# Altium schematic sheet Slave_Sheet2.SchDoc
size A4
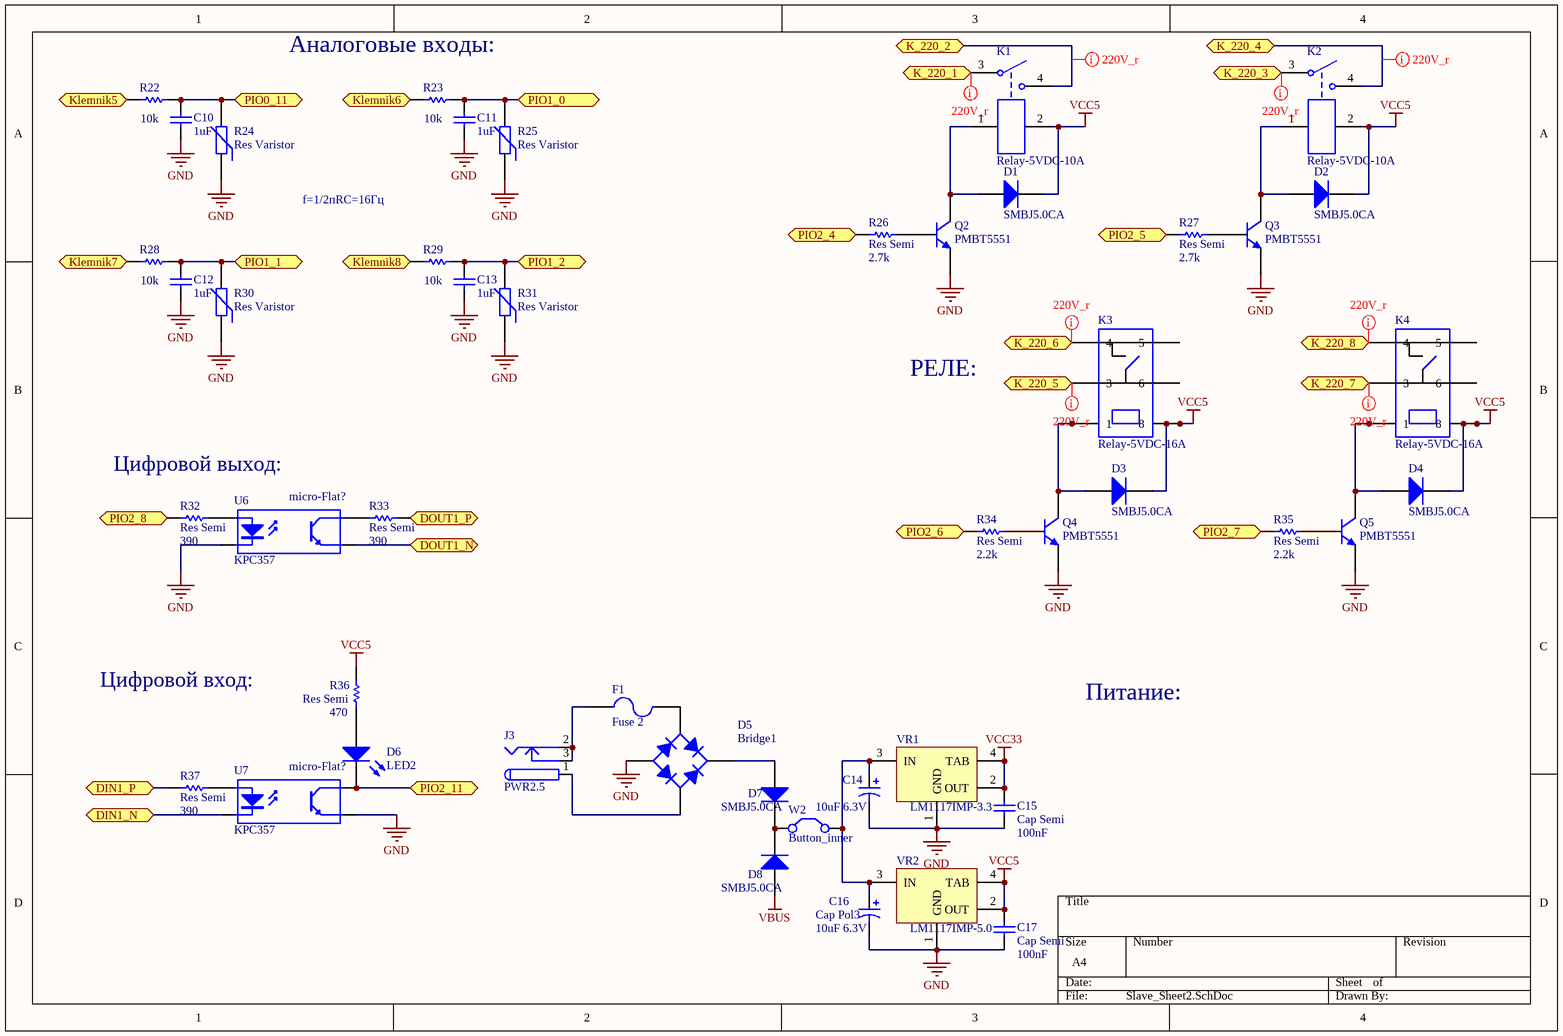
[diagram p0: Slave_Sheet2.SchDoc]

## Parts
C10  value 1uF  [CAPC2012M]  (hidden comment: Cap Semi)
C11  value 1uF  [CAPC2012M]  (hidden comment: Cap Semi)
C12  value 1uF  [CAPC2012M]  (hidden comment: Cap Semi)
C13  value 1uF  [CAPC2012M]  (hidden comment: Cap Semi)
C14  value 10uF 6.3V  [CAPC4532L]  (hidden comment: Cap Pol3)
C15  Cap Semi  value 100nF  [CAPC2012M]
C16  Cap Pol3  value 10uF 6.3V  [CAPC4532L]
C17  Cap Semi  value 100nF  [CAPC2012M]
D1  SMBJ5.0CA  [SMB]
D2  SMBJ5.0CA  [SMB]
D3  SMBJ5.0CA  [SMB]
D4  SMBJ5.0CA  [SMB]
D5  Bridge1  [DB-1S]
D6  LED2  [CD3216-1206]
D7  SMBJ5.0CA  [SMB]
D8  SMBJ5.0CA  [SMB]
F1  Fuse 2  [CD4532-1812]
J3  PWR2.5  [KLD-0202]
K1  Relay-5VDC-10A  [TRCF-SB]
K2  Relay-5VDC-10A  [TRCF-SB]
K3  Relay-5VDC-16A  [TRIH-AE]
K4  Relay-5VDC-16A  [TRIH-AE]
Q2  PMBT5551  [SOT23_M]
Q3  PMBT5551  [SOT23_M]
Q4  PMBT5551  [SOT23_M]
Q5  PMBT5551  [SOT23_M]
R22  value 10k  [RESC2012M]  (hidden comment: Res Semi)
R23  value 10k  [RESC2012M]  (hidden comment: Res Semi)
R24  Res Varistor  [RESC3216L]
R25  Res Varistor  [RESC3216L]
R26  Res Semi  value 2.7k  [RESC2012M]
R27  Res Semi  value 2.7k  [RESC2012M]
R28  value 10k  [RESC2012M]  (hidden comment: Res Semi)
R29  value 10k  [RESC2012M]  (hidden comment: Res Semi)
R30  Res Varistor  [RESC3216L]
R31  Res Varistor  [RESC3216L]
R32  Res Semi  value 390  [RESC2012M]
R33  Res Semi  value 390  [RESC2012M]
R34  Res Semi  value 2.2k  [RESC2012M]
R35  Res Semi  value 2.2k  [RESC2012M]
R36  Res Semi  value 470  [RESC2012M]
R37  Res Semi  value 390  [RESC2012M]
U6  KPC357  [Micro-Flat]
U7  KPC357  [Micro-Flat]
VR1  LM1117IMP-3.3  [MP04A_N]
VR2  LM1117IMP-5.0  [MP04A_N]
W2  Button_inner  [HDR1X2]

## Ports
DIN1_N (bidir), DIN1_P (bidir), DOUT1_N (bidir), DOUT1_P (bidir), K_220_1 (bidir), K_220_2 (bidir), K_220_3 (bidir), K_220_4 (bidir), K_220_5 (bidir), K_220_6 (bidir), K_220_7 (bidir), K_220_8 (bidir), Klemnik5 (bidir), Klemnik6 (bidir), Klemnik7 (bidir), Klemnik8 (bidir), PIO0_11 (bidir), PIO1_0 (bidir), PIO1_1 (bidir), PIO1_2 (bidir), PIO2_4 (bidir), PIO2_5 (bidir), PIO2_6 (bidir), PIO2_7 (bidir), PIO2_8 (bidir), PIO2_11 (bidir)

## Nets
GND: C10.1 C11.1 C12.1 C13.1 C14.2 C15.1 C16.2 C17.1 D5.3(A) Q2.2(E) Q3.2(E) Q4.2(E) Q5.2(E) R24.1 R25.1 R30.1 R31.1 U6.2(K) U7.3(E) VR1.1(GND) VR2.1(GND)
VBUS: D8.1(A)
VCC5: C17.2 D1.2(K) D2.2(K) D3.2(K) D4.2(K) K1.2 K2.2 K3.8 K4.8 R36.1 VR2.2(OUT) VR2.4(TAB)
VCC33: C15.2 VR1.2(OUT) VR1.4(TAB)
DIN1_N: U7.2(K) ; port DIN1_N
DIN1_P: R37.2 ; port DIN1_P
DOUT1_N: U6.3(E) ; port DOUT1_N
DOUT1_P: R33.1 ; port DOUT1_P
K_220_1: K1.3 ; port K_220_1
K_220_2: K1.4 ; port K_220_2
K_220_3: K2.3 ; port K_220_3
K_220_4: K2.4 ; port K_220_4
K_220_5: K3.3 ; port K_220_5
K_220_6: K3.4 ; port K_220_6
K_220_7: K4.3 ; port K_220_7
K_220_8: K4.4 ; port K_220_8
Klemnik5: R22.2 ; port Klemnik5
Klemnik6: R23.2 ; port Klemnik6
Klemnik7: R28.2 ; port Klemnik7
Klemnik8: R29.2 ; port Klemnik8
PIO0_11: C10.2 R22.1 R24.2 ; port PIO0_11
PIO1_0: C11.2 R23.1 R25.2 ; port PIO1_0
PIO1_1: C12.2 R28.1 R30.2 ; port PIO1_1
PIO1_2: C13.2 R29.1 R31.2 ; port PIO1_2
PIO2_4: R26.2 ; port PIO2_4
PIO2_5: R27.2 ; port PIO2_5
PIO2_6: R34.2 ; port PIO2_6
PIO2_7: R35.2 ; port PIO2_7
PIO2_8: R32.2 ; port PIO2_8
PIO2_11: D6.2(K) U7.4(C) ; port PIO2_11
NetC14_1: C14.1 C16.1 VR1.3(IN) VR2.3(IN) W2.2(C2)
NetD1_1: D1.1(A) K1.1 Q2.3(C)
NetD2_1: D2.1(A) K2.1 Q3.3(C)
NetD3_1: D3.1(A) K3.1 Q4.3(C)
NetD4_1: D4.1(A) K4.1 Q5.3(C)
NetD5_1: D5.1(K) D7.1(A)
NetD5_2: D5.2(C) J3.1
NetD5_4: D5.4(C) F1.2
NetD6_1: D6.1(A) R36.2
NetD7_2: D7.2(K) D8.2(K) W2.1(C1)
NetF1_1: F1.1 J3.2 J3.3
NetQ2_1: Q2.1(B) R26.1
NetQ3_1: Q3.1(B) R27.1
NetQ4_1: Q4.1(B) R34.1
NetQ5_1: Q5.1(B) R35.1
NetR32_1: R32.1 U6.1(A)
NetR33_2: R33.2 U6.4(C)
NetR37_1: R37.1 U7.1(A)

Not connected (* = marked no-connect by the designer): K3 5 6; K4 5 6

## Layout directives
net class 220V_r: K_220_1, K_220_2, K_220_3, K_220_4, K_220_5, K_220_6, K_220_7, K_220_8

## Notes on the sheet
- Аналоговые входы:
- f=1/2пRC=16Гц
- РЕЛЕ:
- Цифровой выход:
- micro-Flat?
- Цифровой вход:
- Питание:
- (near D6) micro-Flat?

## Library data of the parts
C10-C13 C15 C17 = Cap Semi: Capacitor (Semiconductor SIM Model); Published: 8-Jun-2000; LatestRevisionDate: 29-May-2009; LatestRevisionNote: IPC-7351 Footprint Added.; PackageReference: C1206; Publisher: Altium Limited; PackageDescription: Chip Capacitor
C14 C16 = Cap Pol3: Polarized Capacitor (Surface Mount); Published: 8-Jun-2000; LatestRevisionDate: 29-May-2009; LatestRevisionNote: IPC-7351 Footprint Added.; PackageReference: C0805; Publisher: Altium Limited; PackageDescription: Chip Capacitor
D1-D4 D7 D8 = Diode 1N4007: 1 Amp General Purpose Rectifier; Published: 8-Jun-2000; LatestRevisionDate: 17-Jul-2002; LatestRevisionNote: Re-released for DXP Platform.; DatasheetDocument: 1998; PackageDocument: Aug-1999; PackageReference: DO-41; Publisher: Altium Limited; Code_JEDEC: DO-204-AL; ComponentLink1Description: Manufacturer Link; ComponentLink1URL: http://www.fairchildsemi.com/; ComponentLink2Description: Datasheet; ComponentLink2URL: http://www.fairchildsemi.com/ds/1N%2F1N4001.pdf
D5 = Bridge1: Full Wave Diode Bridge; Published: 8-Jun-2000; LatestRevisionDate: 29-May-2009; LatestRevisionNote: Sch pins A & K swapped.; DatasheetVersion: E2732B; PackageReference: D-38; Publisher: Altium Limited
D6 = LED2: Typical RED, GREEN, YELLOW, AMBER GaAs LED; Published: 8-Jun-2000; LatestRevisionDate: 17-Jul-2002; LatestRevisionNote: Re-released for DXP Platform.; PackageVersion: Feb-2002; PackageReference: 3.2X1.6X1.1; Publisher: Altium Limited
F1 = Fuse 2: Fuse; Published: 8-Jun-2000; LatestRevisionDate: 17-Jul-2002; LatestRevisionNote: Re-released for DXP Platform.; PackageReference: PIN-W2/E2.8; Publisher: Altium Limited
J3 = PWR2.5: Low Voltage Power Supply Connector; Published: 17-Dec-2003; DatasheetDocument: 09-May-2002; Publisher: Altium Limited; ComponentLink1Description: Manufacturer Link; ComponentLink1URL: http://domino.kycon.com/internet/Products.html
K1 K2 = Relay-5VDC-10A: TRCF-5VDC-SB-A; Published: 24-Mar-1999; LatestRevisionDate: 17-Jul-2002; LatestRevisionNote: Re-released for DXP Platform.; PackageReference: MODULE5B; Publisher: Altium Limited; MODEL: TRCF-5VDC-SB-A
K3 K4 = Relay-5VDC-16A: TRIH-5VDC-SD-1AE-R; Published: 24-Mar-1999; LatestRevisionDate: 17-Jul-2002; LatestRevisionNote: Re-released for DXP Platform.; PackageReference: MODULE5B; Publisher: Altium Limited; MODEL: TRIH-5VDC-SD-1AE-R
Q2-Q5 = PMBT5551: NPN Switching Transistor; Published: 17-Sep-2003; LatestRevisionDate: 12-Dec-2006; LatestRevisionNote: IPC-7351 Footprint Added.; DatasheetVersion: 13-May-2002; PackageVersion: May-1999; PackageReference: SOT23; Publisher: Altium Limited; PackageDescription: 3-Pin SOT-23 Package 0.95 mm Pitch, 2.3 mm Lead Span; ComponentLink1Description: Manufacturer Link; ComponentLink1URL: http://www.semiconductors.philips.com/; ComponentLink2Description: Datasheet; ComponentLink2URL: http://www.semiconductors.philips.com/acrobat/datasheets/MMBT3904_4.pdf
R22 R23 R26-R29 R32-R37 = Res Semi: Semiconductor Resistor; Published: 8-Jun-2000; LatestRevisionDate: 17-Jul-2002; LatestRevisionNote: Re-released for DXP Platform.; PackageReference: AXIAL-0.5; Publisher: Altium Limited
R24 R25 R30 R31 = Res Varistor: Varistor (Voltage-Sensitive Resistor); Published: 24-Mar-1999; LatestRevisionDate: 29-May-2009; LatestRevisionNote: IPC-7351 Footprint Added.; PackageVersion: Mar-2003; PackageReference: 6-0805; Publisher: Altium Limited; PackageDescription: Chip Resistor 0805 Case Size; Code_IPC: RESC2012
U6 U7 = Optoisolator1: 4-Pin Phototransistor Optocoupler; Published: 24-Mar-1999; LatestRevisionDate: 04-Mar-2005; LatestRevisionNote: Sch pins 3 & 4 Swapped.; DatasheetVersion: Nov-2003; PackageReference: DIP-4; Publisher: Altium Limited
VR1 = LM1117IMP-3.3: 800mA Low-Dropout Linear Regulator; Manufacturer: National Semiconductor; CompType: LDO IC; PackageTopMarking: XYTT*N05B; PowerWise: N; Published: 4-Dec-2008; DatasheetVersion: Apr-2006; PackageVersion: revB, Apr-2003; PackageReference: MP04A; Publisher: Altium Limited; PackageDescription: Molded SOT-223, 6.50 x 3.56 x 1.6mm Body, 4 Lead, 2.3mm Pitch; PartNumber: LM1117IMP-3.3; RoHS: O; PinCount: 4; DigiKeyPartNumber: LM1117IMP-3.3CT-ND; Code_JEDEC: TO-261-AA; Code_IPC: SOT223-4; ComponentLink1Description: LM1117 Datasheet; ComponentLink1URL: http://www.national.com/ds/LM/LM1117.pdf; ComponentLink2Description: LM1117 Web Page; ComponentLink2URL: http://www.national.com/pf/LM/LM1117.html; ComponentLink3Description: MP04A Package Page; ComponentLink3URL: http://www.national.com/packaging/folders/mp04a.html
VR2 = LM1117IMP-5.0: 800mA Low-Dropout Linear Regulator; Manufacturer: National Semiconductor; CompType: LDO IC; PackageTopMarking: XYTT*N06B; PowerWise: N; Published: 4-Dec-2008; DatasheetVersion: Apr-2006; PackageVersion: revB, Apr-2003; PackageReference: MP04A; Publisher: Altium Limited; PackageDescription: Molded SOT-223, 6.50 x 3.56 x 1.6mm Body, 4 Lead, 2.3mm Pitch; PartNumber: LM1117IMP-5.0; RoHS: O; PinCount: 4; DigiKeyPartNumber: LM1117IMP-5.0CT-ND; Code_JEDEC: TO-261-AA; Code_IPC: SOT223-4; ComponentLink1Description: LM1117 Datasheet; ComponentLink1URL: http://www.national.com/ds/LM/LM1117.pdf; ComponentLink2Description: LM1117 Web Page; ComponentLink2URL: http://www.national.com/pf/LM/LM1117.html; ComponentLink3Description: MP04A Package Page; ComponentLink3URL: http://www.national.com/packaging/folders/mp04a.html
W2 = Button_inner: Power Button; Published: 24-Mar-1999; LatestRevisionDate: 17-Jul-2002; LatestRevisionNote: Re-released for DXP Platform.; PackageReference: RAD-0.2; Publisher: Altium Limited